# Altium schematic sheet NO2_Potentiostat.SchDoc
size A4
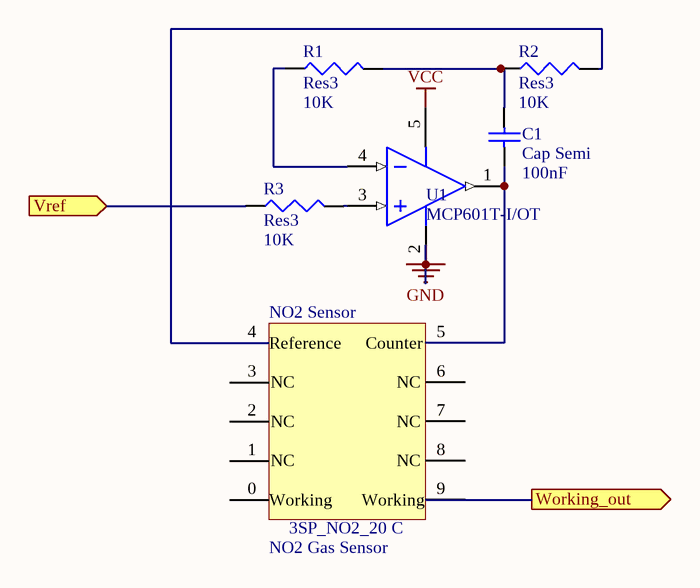
[diagram p0: NO2_Potentiostat.SchDoc]

## Parts
C1  Cap Semi  value 100nF  [C1206]
NO2_Sensor  NO2 Gas Sensor  [Spec_Sensor]
R1  Res3  value 10K  [J1-0603]
R2  Res3  value 10K  [J1-0603]
R3  Res3  value 10K  [J1-0603]
U1  MCP601T-I/OT  [SOT-23-OT5_L]

## Ports
Vref (in), Working_out (out)

## Nets
GND: U1.2(VSS)
VCC: U1.5(VDD)
Vref: R3.1 ; port Vref
Working_out: NO2_Sensor.9(Working) ; port Working_out
NetC1_1: C1.1 NO2_Sensor.5(Counter) U1.1(VOUT)
NetC1_2: C1.2 R1.2 R2.1
NetNO2_Sensor_4: NO2_Sensor.4(Reference) R2.2
NetR1_1: R1.1 U1.4(VIN-)
NetR3_2: R3.2 U1.3(VIN+)

Not connected (* = marked no-connect by the designer): NO2_Sensor 0(Working) 1(NC) 2(NC) 3(NC) 6(NC) 7(NC) 8(NC)

## Notes on the sheet
- (in symbol 3SP_NO2_5F C) 3SP_NO2_20 C

## Library data of the parts
C1 = Cap Semi: Capacitor (Semiconductor SIM Model); Published: 8-Jun-2000; LatestRevisionDate: 29-May-2009; LatestRevisionNote: IPC-7351 Footprint Added.; PackageReference: C1206; Publisher: Altium Limited; PackageDescription: Chip Capacitor
NO2_Sensor = 3SP_NO2_5F C: 3SP_NO2_5F C Package 110-508
R1-R3 = Res3: Resistor; Published: 8-Jun-2000; LatestRevisionDate: 29-May-2009; LatestRevisionNote: IPC-7351 Footprint Added.; PackageReference: J1-0603; Publisher: Altium Limited; PackageDescription: Chip Resistor
U1 = CMP-0187-00433-2: 2.7V to 6.0V Single Supply CMOS Operational Amplifier, 5-Pin SOT-23, Industrial Temperature, Tape and Reel; Code_IPC: SOT23-5; ComponentLink3Description: Package Specification; RevisionNote: URLs added.; PackageReference: SOT-23-OT5; ComponentLink3URL: http://www.microchip.com/stellent/groups/techpub_sg/documents/packagingspec/en012702.pdf; ComponentLink1Description: Manufacturer URL; DatasheetVersion: revG, Dec-2007; PackageDescription: 5-Lead Plastic Small Outline Transistor (OT) [SOT-23]; PackageVersion: revBB, Aug-2009; ComponentLink2Description: Datasheet; ComponentLink1URL: http://www.microchip.com/; ComponentLink2URL: http://ww1.microchip.com/downloads/en/DeviceDoc/21314g.pdf